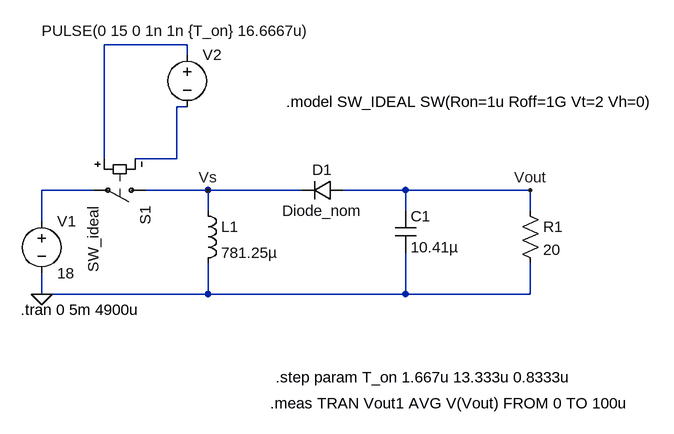
[diagram p0: schematic Draft2.asc]
Draft2.asc, the LTspice schematic file:
Version 4
SHEET 1 1004 680
WIRE 240 -96 112 -96
WIRE 240 -80 240 -96
WIRE 240 0 224 0
WIRE 112 80 112 -96
WIRE 224 80 224 0
WIRE 224 80 160 80
WIRE 96 128 16 128
WIRE 272 128 176 128
WIRE 416 128 272 128
WIRE 576 128 480 128
WIRE 768 128 576 128
WIRE 272 160 272 128
WIRE 576 160 576 128
WIRE 768 160 768 128
WIRE 16 176 16 128
WIRE 16 288 16 256
WIRE 272 288 272 240
WIRE 272 288 16 288
WIRE 576 288 576 224
WIRE 576 288 272 288
WIRE 768 288 768 240
WIRE 768 288 576 288
FLAG 16 288 0
FLAG 768 128 Vout
FLAG 272 128 Vs
SYMBOL voltage 16 160 R0
WINDOW 123 0 0 Left 0
WINDOW 39 0 0 Left 0
SYMATTR InstName V1
SYMATTR Value 18
SYMBOL ind 256 144 R0
SYMATTR InstName L1
SYMATTR Value 781.25µ
SYMATTR SpiceLine Rser=0.2
SYMBOL diode 480 112 R90
WINDOW 0 0 32 VBottom 2
WINDOW 3 32 32 VTop 2
SYMATTR InstName D1
SYMATTR Value Diode_nom
SYMBOL cap 560 160 R0
SYMATTR InstName C1
SYMATTR Value 10.41µ
SYMBOL res 752 144 R0
SYMATTR InstName R1
SYMATTR Value 20
SYMBOL voltage 240 -96 R0
WINDOW 3 -224 -21 Left 2
WINDOW 123 0 0 Left 0
WINDOW 39 0 0 Left 0
SYMATTR InstName V2
SYMATTR Value PULSE(0 15 0 1n 1n {T_on} 16.6667u)
SYMBOL sw 192 128 R90
SYMATTR InstName S1
SYMATTR Value SW_ideal
TEXT -16 312 Left 2 !.tran 0 5m 4900u
TEXT 392 -8 Left 2 !.model SW_IDEAL SW(Ron=1u Roff=1G Vt=2 Vh=0)
TEXT 376 416 Left 2 !.step param T_on 1.667u 13.333u 0.8333u
TEXT 368 456 Left 2 !.meas TRAN Vout1 AVG V(Vout) FROM 0 TO 100u

The netlist it stands for:
* Draft2.asc
V1 N003 0 18
L1 Vs 0 781.25µ Rser=0.2
D1 Vout Vs Diode_nom
C1 Vout 0 10.41µ
R1 Vout 0 20
V2 N001 N002 PULSE(0 15 0 1n 1n {T_on} 16.6667u)
S1 Vs N003 N001 N002 SW_ideal
.model D D
.lib standard.dio
.tran 0 5m 4900u
.model SW_IDEAL SW(Ron=1u Roff=1G Vt=2 Vh=0)
.step param T_on 1.667u 13.333u 0.8333u
.meas TRAN Vout1 AVG V(Vout) FROM 0 TO 100u
.backanno
.end